# Altium schematic sheet 8_VI Interface.schdoc
size 431 x 309 mm; Symbol: Sheet-Symbol_A4; Device: Sheet-Symbol_A4; Company: 嘉立创EDA; Version: V1.0; Page Size: A4; @Project Name: RK3568核心板; @Page Count: 8; @Update Date: 2024-10-10; @Create Date: 2024-10-10; @Schematic Name: Schematic1; @Page No: 7; @Page Name: VI Interface; @Board Name: Board1; @Create Time: 10:30:23; @Update Time: 10:51:59; Width: 1655; Height: 1170; Region Start: 1; X Region Count: 6; Y Region Count: 4; Blade Width: 10; Title Block Position: 3
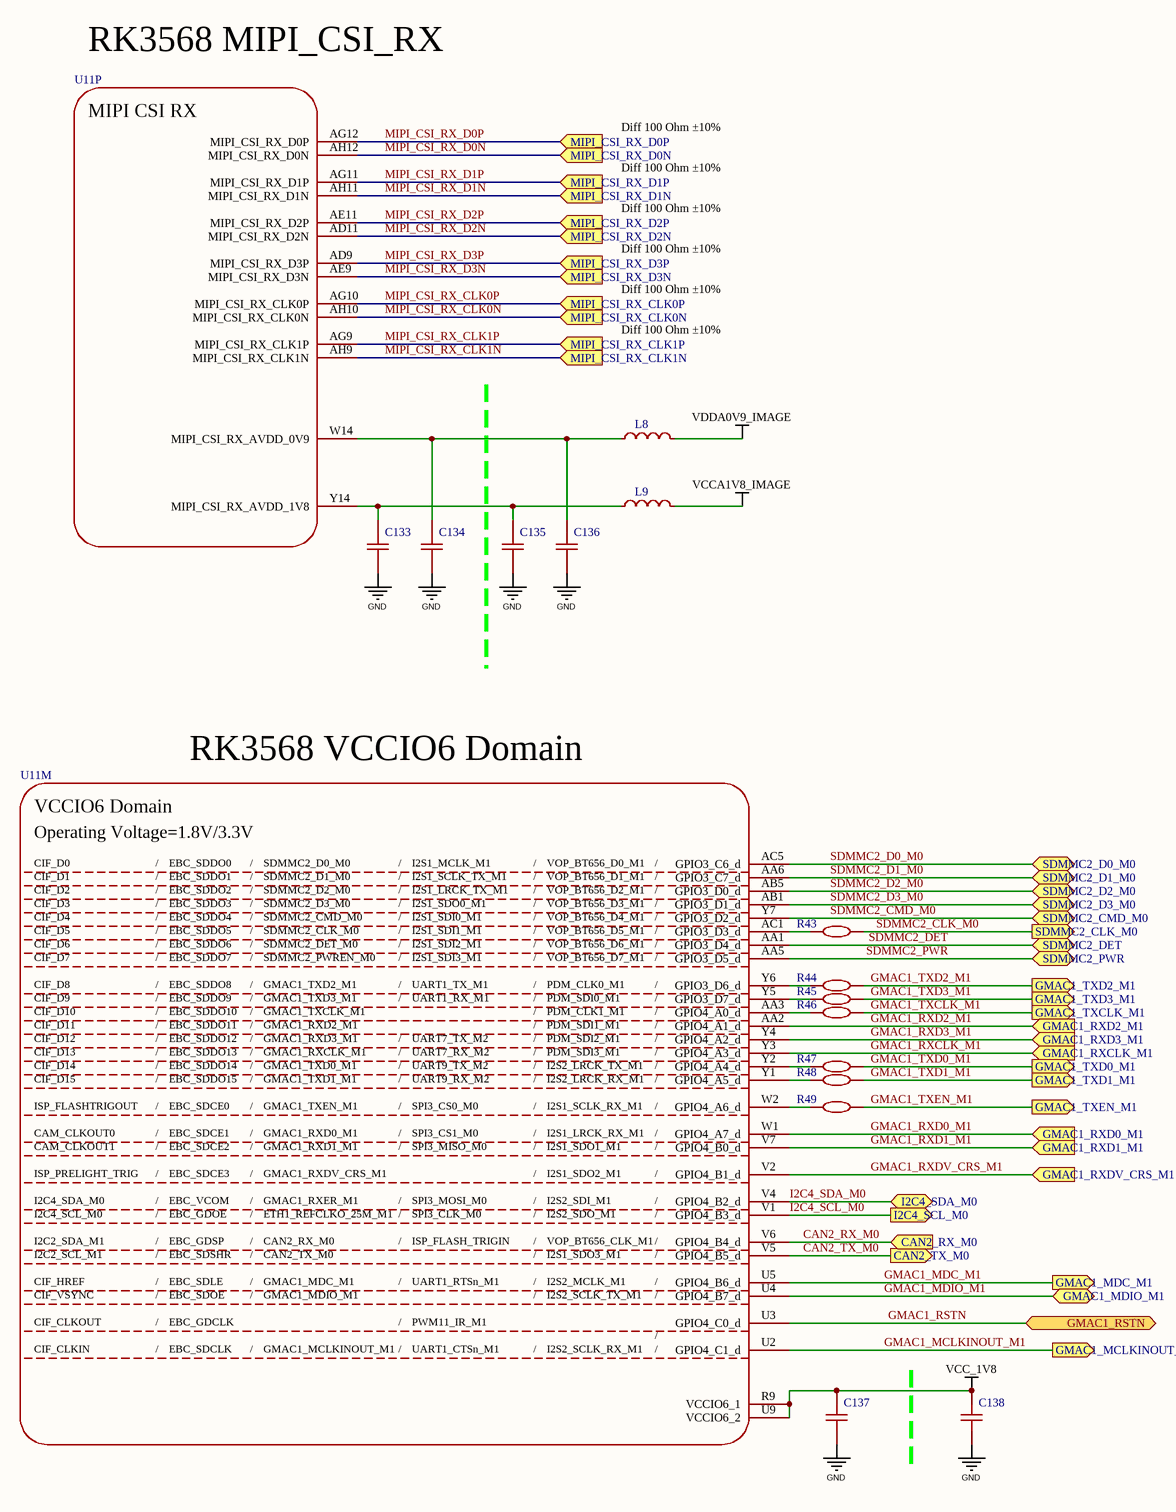
[diagram p0: 8_VI Interface.schdoc]

## Parts
C133  100nF  [C0201]  (value not drawn)
C134  100nF  [C0201]  (value not drawn)
C135  1uF  [C0402]  (value not drawn)
C136  1uF  [C0402]  (value not drawn)
C137  100nF  [C0201]  (value not drawn)
C138  1uF  [C0402]  (value not drawn)
L8  120R 100MHz  [L0603]  (value not drawn)
L9  120R 100MHz  [L0603]  (value not drawn)
R43  22Ω  [R0201]  (value not drawn)
R44  22Ω  [R0201]  (value not drawn)
R45  22Ω  [R0201]  (value not drawn)
R46  22Ω  [R0201]  (value not drawn)
R47  22Ω  [R0201]  (value not drawn)
R48  22Ω  [R0201]  (value not drawn)
R49  22Ω  [R0201]  (value not drawn)
U11  SOC_RK3568  [RK3568]  (value not drawn)  (parts M,P of 23)

## Ports
CAN2_RX_M0 (in), CAN2_TX_M0 (out), GMAC1_MCLKINOUT_M1 (out), GMAC1_MDC_M1 (out), GMAC1_MDIO_M1 (bidir), GMAC1_RSTN (bidir), GMAC1_RXCLK_M1 (in), GMAC1_RXD0_M1 (in), GMAC1_RXD1_M1 (in), GMAC1_RXD2_M1 (in), GMAC1_RXD3_M1 (in), GMAC1_RXDV_CRS_M1 (in), GMAC1_TXCLK_M1 (out), GMAC1_TXD0_M1 (out), GMAC1_TXD1_M1 (out), GMAC1_TXD2_M1 (out), GMAC1_TXD3_M1 (out), GMAC1_TXEN_M1 (out), I2C4_SCL_M0 (out), I2C4_SDA_M0 (bidir), MIPI_CSI_RX_CLK0N (in), MIPI_CSI_RX_CLK0P (in), MIPI_CSI_RX_CLK1N (in), MIPI_CSI_RX_CLK1P (in), MIPI_CSI_RX_D0N (in), MIPI_CSI_RX_D0P (in), MIPI_CSI_RX_D1N (in), MIPI_CSI_RX_D1P (in), MIPI_CSI_RX_D2N (in), MIPI_CSI_RX_D2P (in), MIPI_CSI_RX_D3N (in), MIPI_CSI_RX_D3P (in), SDMMC2_CLK_M0 (out), SDMMC2_CMD_M0 (bidir), SDMMC2_D0_M0 (bidir), SDMMC2_D1_M0 (bidir), SDMMC2_D2_M0 (bidir), SDMMC2_D3_M0 (bidir), SDMMC2_DET (bidir), SDMMC2_PWR (bidir)

## Nets
GND: C133.1 C134.1 C135.1 C136.1 C137.1 C138.1
VCC_1V8: C137.2 C138.2 U11.R9(VCCIO6_1) U11.U9(VCCIO6_2)
VCCA1V8_IMAGE: L9.2
VDDA0V9_IMAGE: L8.2
CAN2_RX_M0: U11.V6(GPIO4_B4_d) ; port CAN2_RX_M0
CAN2_TX_M0: U11.V5(GPIO4_B5_d) ; port CAN2_TX_M0
GMAC1_MCLKINOUT_M1: U11.U2(GPIO4_C1_d) ; port GMAC1_MCLKINOUT_M1
GMAC1_MDC_M1: U11.U5(GPIO4_B6_d) ; port GMAC1_MDC_M1
GMAC1_MDIO_M1: U11.U4(GPIO4_B7_d) ; port GMAC1_MDIO_M1
GMAC1_RSTN: U11.U3(GPIO4_C0_d) ; port GMAC1_RSTN
GMAC1_RXCLK_M1: U11.Y3(GPIO4_A3_d) ; port GMAC1_RXCLK_M1
GMAC1_RXD0_M1: U11.W1(GPIO4_A7_d) ; port GMAC1_RXD0_M1
GMAC1_RXD1_M1: U11.V7(GPIO4_B0_d) ; port GMAC1_RXD1_M1
GMAC1_RXD2_M1: U11.AA2(GPIO4_A1_d) ; port GMAC1_RXD2_M1
GMAC1_RXD3_M1: U11.Y4(GPIO4_A2_d) ; port GMAC1_RXD3_M1
GMAC1_RXDV_CRS_M1: U11.V2(GPIO4_B1_d) ; port GMAC1_RXDV_CRS_M1
GMAC1_TXCLK_M1: R46.2 ; port GMAC1_TXCLK_M1
GMAC1_TXD0_M1: R47.2 ; port GMAC1_TXD0_M1
GMAC1_TXD1_M1: R48.2 ; port GMAC1_TXD1_M1
GMAC1_TXD2_M1: R44.2 ; port GMAC1_TXD2_M1
GMAC1_TXD3_M1: R45.2 ; port GMAC1_TXD3_M1
GMAC1_TXEN_M1: R49.2 ; port GMAC1_TXEN_M1
I2C4_SCL_M0: U11.V1(GPIO4_B3_d) ; port I2C4_SCL_M0
I2C4_SDA_M0: U11.V4(GPIO4_B2_d) ; port I2C4_SDA_M0
MIPI_CSI_RX_CLK0N: U11.AH10(MIPI_CSI_RX_CLK0N) ; port MIPI_CSI_RX_CLK0N
MIPI_CSI_RX_CLK0P: U11.AG10(MIPI_CSI_RX_CLK0P) ; port MIPI_CSI_RX_CLK0P
MIPI_CSI_RX_CLK1N: U11.AH9(MIPI_CSI_RX_CLK1N) ; port MIPI_CSI_RX_CLK1N
MIPI_CSI_RX_CLK1P: U11.AG9(MIPI_CSI_RX_CLK1P) ; port MIPI_CSI_RX_CLK1P
MIPI_CSI_RX_D0N: U11.AH12(MIPI_CSI_RX_D0N) ; port MIPI_CSI_RX_D0N
MIPI_CSI_RX_D0P: U11.AG12(MIPI_CSI_RX_D0P) ; port MIPI_CSI_RX_D0P
MIPI_CSI_RX_D1N: U11.AH11(MIPI_CSI_RX_D1N) ; port MIPI_CSI_RX_D1N
MIPI_CSI_RX_D1P: U11.AG11(MIPI_CSI_RX_D1P) ; port MIPI_CSI_RX_D1P
MIPI_CSI_RX_D2N: U11.AD11(MIPI_CSI_RX_D2N) ; port MIPI_CSI_RX_D2N
MIPI_CSI_RX_D2P: U11.AE11(MIPI_CSI_RX_D2P) ; port MIPI_CSI_RX_D2P
MIPI_CSI_RX_D3N: U11.AE9(MIPI_CSI_RX_D3N) ; port MIPI_CSI_RX_D3N
MIPI_CSI_RX_D3P: U11.AD9(MIPI_CSI_RX_D3P) ; port MIPI_CSI_RX_D3P
SDMMC2_CLK_M0: R43.2 ; port SDMMC2_CLK_M0
SDMMC2_CMD_M0: U11.Y7(GPIO3_D2_d) ; port SDMMC2_CMD_M0
SDMMC2_D0_M0: U11.AC5(GPIO3_C6_d) ; port SDMMC2_D0_M0
SDMMC2_D1_M0: U11.AA6(GPIO3_C7_d) ; port SDMMC2_D1_M0
SDMMC2_D2_M0: U11.AB5(GPIO3_D0_d) ; port SDMMC2_D2_M0
SDMMC2_D3_M0: U11.AB1(GPIO3_D1_d) ; port SDMMC2_D3_M0
SDMMC2_DET: U11.AA1(GPIO3_D4_d) ; port SDMMC2_DET
SDMMC2_PWR: U11.AA5(GPIO3_D5_d) ; port SDMMC2_PWR
NetC133_2: C133.2 C135.2 L9.1 U11.Y14(MIPI_CSI_RX_AVDD_1V8)
NetC134_2: C134.2 C136.2 L8.1 U11.W14(MIPI_CSI_RX_AVDD_0V9)
NetR43_1: R43.1 U11.AC1(GPIO3_D3_d)
NetR44_1: R44.1 U11.Y6(GPIO3_D6_d)
NetR45_1: R45.1 U11.Y5(GPIO3_D7_d)
NetR46_1: R46.1 U11.AA3(GPIO4_A0_d)
NetR47_1: R47.1 U11.Y2(GPIO4_A4_d)
NetR48_1: R48.1 U11.Y1(GPIO4_A5_d)
NetR49_1: R49.1 U11.W2(GPIO4_A6_d)

## Notes on the sheet
- RK3568 MIPI_CSI_RX
- Diff 100 Ohm ±10%
- RK3568 VCCIO6 Domain
- 1
- 2
- 3
- 4
- 5
- 6
- A
- B
- C
- D
- 原理图
- Schematic1
- 创建日期
- 更新日期
- 2024-10-10
- 审阅
- 绘制
- 图页
- VI Interface
- 物料编码
- RK3568核心板
- 版本
- 尺寸
- 页
- 7
- 共
- 8
- V1.0
- A4
- 嘉立创EDA
- (in symbol SOC_RK3568, part M) VCCIO6 Domain; Operating Voltage=1.8V/3.3V; CIF_D0; /; EBC_SDDO0; SDMMC2_D0_M0; I2S1_MCLK_M1; VOP_BT656_D0_M1; CIF_D1; EBC_SDDO1; SDMMC2_D1_M0; I2S1_SCLK_TX_M1; VOP_BT656_D1_M1; CIF_D2; EBC_SDDO2; SDMMC2_D2_M0; I2S1_LRCK_TX_M1; VOP_BT656_D2_M1; CIF_D3; EBC_SDDO3; SDMMC2_D3_M0; I2S1_SDO0_M1; VOP_BT656_D3_M1; CIF_D4; EBC_SDDO4; SDMMC2_CMD_M0; I2S1_SDI0_M1; VOP_BT656_D4_M1; CIF_D5; EBC_SDDO5; SDMMC2_CLK_M0; I2S1_SDI1_M1; VOP_BT656_D5_M1; CIF_D6; EBC_SDDO6; SDMMC2_DET_M0; I2S1_SDI2_M1; VOP_BT656_D6_M1; CIF_D7; EBC_SDDO7; SDMMC2_PWREN_M0; I2S1_SDI3_M1; VOP_BT656_D7_M1; CIF_D8; EBC_SDDO8; GMAC1_TXD2_M1; UART1_TX_M1; PDM_CLK0_M1; CIF_D9; EBC_SDDO9; GMAC1_TXD3_M1; UART1_RX_M1; PDM_SDI0_M1; CIF_D10; EBC_SDDO10; GMAC1_TXCLK_M1; PDM_CLK1_M1; CIF_D11; EBC_SDDO11; GMAC1_RXD2_M1; PDM_SDI1_M1; CIF_D12; EBC_SDDO12; GMAC1_RXD3_M1; UART7_TX_M2; PDM_SDI2_M1; CIF_D13; EBC_SDDO13; GMAC1_RXCLK_M1; UART7_RX_M2; PDM_SDI3_M1; CIF_D14; EBC_SDDO14; GMAC1_TXD0_M1; UART9_TX_M2; I2S2_LRCK_TX_M1; CIF_D15; EBC_SDDO15; GMAC1_TXD1_M1; UART9_RX_M2; I2S2_LRCK_RX_M1; ISP_FLASHTRIGOUT; EBC_SDCE0; GMAC1_TXEN_M1; SPI3_CS0_M0; I2S1_SCLK_RX_M1; CAM_CLKOUT0; EBC_SDCE1; GMAC1_RXD0_M1; SPI3_CS1_M0; I2S1_LRCK_RX_M1; CAM_CLKOUT1; EBC_SDCE2; GMAC1_RXD1_M1; SPI3_MISO_M0; I2S1_SDO1_M1; ISP_PRELIGHT_TRIG; EBC_SDCE3; GMAC1_RXDV_CRS_M1; I2S1_SDO2_M1; I2C4_SDA_M0; EBC_VCOM; GMAC1_RXER_M1; SPI3_MOSI_M0; I2S2_SDI_M1; I2C4_SCL_M0; EBC_GDOE; ETH1_REFCLKO_25M_M1; SPI3_CLK_M0; I2S2_SDO_M1; I2C2_SDA_M1; EBC_GDSP; CAN2_RX_M0; ISP_FLASH_TRIGIN; VOP_BT656_CLK_M1; I2C2_SCL_M1; EBC_SDSHR; CAN2_TX_M0; I2S1_SDO3_M1; CIF_HREF; EBC_SDLE; GMAC1_MDC_M1; UART1_RTSn_M1; I2S2_MCLK_M1; CIF_VSYNC; EBC_SDOE; GMAC1_MDIO_M1; I2S2_SCLK_TX_M1; CIF_CLKOUT; EBC_GDCLK; PWM11_IR_M1; CIF_CLKIN; EBC_SDCLK; GMAC1_MCLKINOUT_M1; UART1_CTSn_M1; I2S2_SCLK_RX_M1
- (in symbol SOC_RK3568, part P) MIPI CSI RX

## Library data of the parts
C133 C134 C137 = CL03A104KO3NNNC: 容值:100nF;精度:±10%;额定电压:16V;材质(温度系数):X5R;; Manufacturer: SAMSUNG(三星); Add into BOM: yes; Tolerance: ±10%; Voltage Rated: 16V; Temperature Coefficient: X5R; Symbol: CL03A104KO3NNNC; Device: CL03A104KO3NNNC; LCSC Part Name: 100nF ±10% 16V; Supplier Part: C307380; Manufacturer Part: CL03A104KO3NNNC; Supplier Footprint: 0201; JLCPCB Part Class: 扩展库; Datasheet: https://atta.szlcsc.com/upload/public/pdf/source/20160218/1457707763339.pdf; Supplier: LCSC; Convert to PCB: yes; Value: 100nF
C135 C136 C138 = CL05A105KA5NQNC: 容值:1uF;精度:±10%;额定电压:25V;材质(温度系数):X5R;; Manufacturer: SAMSUNG(三星); Add into BOM: yes; Tolerance: ±10%; Voltage Rated: 25V; Temperature Coefficient: X5R; Symbol: CL05A105KA5NQNC; Device: CL05A105KA5NQNC; LCSC Part Name: 1uF ±10% 25V; Supplier Part: C52923; Manufacturer Part: CL05A105KA5NQNC; Supplier Footprint: 0402; JLCPCB Part Class: 基础库; Datasheet: https://atta.szlcsc.com/upload/public/pdf/source/20160218/1457707763339.pdf; Supplier: LCSC; Convert to PCB: yes; Value: 1uF
L8 L9 = BLM18PG121SN1D: 标称阻抗@测试频率:120Ω@100MHz;误差:±25%;直流电阻(RDC):50mΩ;; Manufacturer: muRata(村田); Symbol: BLM18PG121SN1D_C14709; Add into BOM: yes; Tolerance: ±25%; DC Resistance: 50mΩ; Current Rating: 2A; Circuits: 1; Device: BLM18PG121SN1D; LCSC Part Name: 单路 0603磁珠 阻抗120Ω@100MHz; Supplier Part: C14709; Manufacturer Part: 120R 100MHz; Supplier Footprint: 0603; JLCPCB Part Class: 扩展库; Datasheet: https://atta.szlcsc.com/upload/public/pdf/source/20130704/1457706621422.pdf; Supplier: LCSC; Convert to PCB: yes; Impedance @ Frequency: 120Ω@100MHz
R43-R49 = 0201WMF220JTEE: 电阻类型:厚膜电阻;阻值:22Ω;精度:±1%;功率:50mW;最大工作电压:25V;温度系数:±200ppm/℃;; Manufacturer: UNI-ROYAL(厚声); Add into BOM: yes; Tolerance: ±1%; Power(Watts): 50mW; Overload Voltage (Max): 25V; Symbol: 0201WMF220JTEE; Device: 0201WMF220JTEE; Supplier: LCSC; Supplier Part: C270355; Manufacturer Part: 0201WMF220JTEE; Value: 22Ω; JLCPCB Part Class: 扩展库; LCSC Part Name: 22Ω ±1% 50mW 厚膜电阻; Supplier Footprint: 0201; Datasheet: https://atta.szlcsc.com/upload/public/pdf/source/20200306/C422600_1E6D84923E4A46A82E41ADD87F860B5C.pdf; Convert to PCB: yes; Type: 厚膜电阻; Temperature Coefficient: ±200ppm/℃; Operating Temperature Range: -55℃~+155℃
U11 = SOC_RK3568: Part Reference: U1000; Manufacturer: Rockchip (瑞芯微); PCB footprint: BGA636_19R00X19R00X1R20; SWAP_INFO: (S1+S2+S3+S4+S5+S6+S7+S8+S9+S10+S11+S12+S13+S14+S15+S16+S17+S18+S19+S20+S21+S22+S23); SPLIT_INST: TRUE; Value: RK3568; Priority: A; Add into BOM: yes; Relevance: []; Symbol: SOC_RK3568; Device: SOC_RK3568; RK PN: RK3568; Part Type: SOC; Manufacturer PN: RK3568; Created by: JJJ; Origin Footprint 2: BGA636_19R00X19R00X1R20; Convert to PCB: yes